# Altium project BM1387_USB.PrjPcb
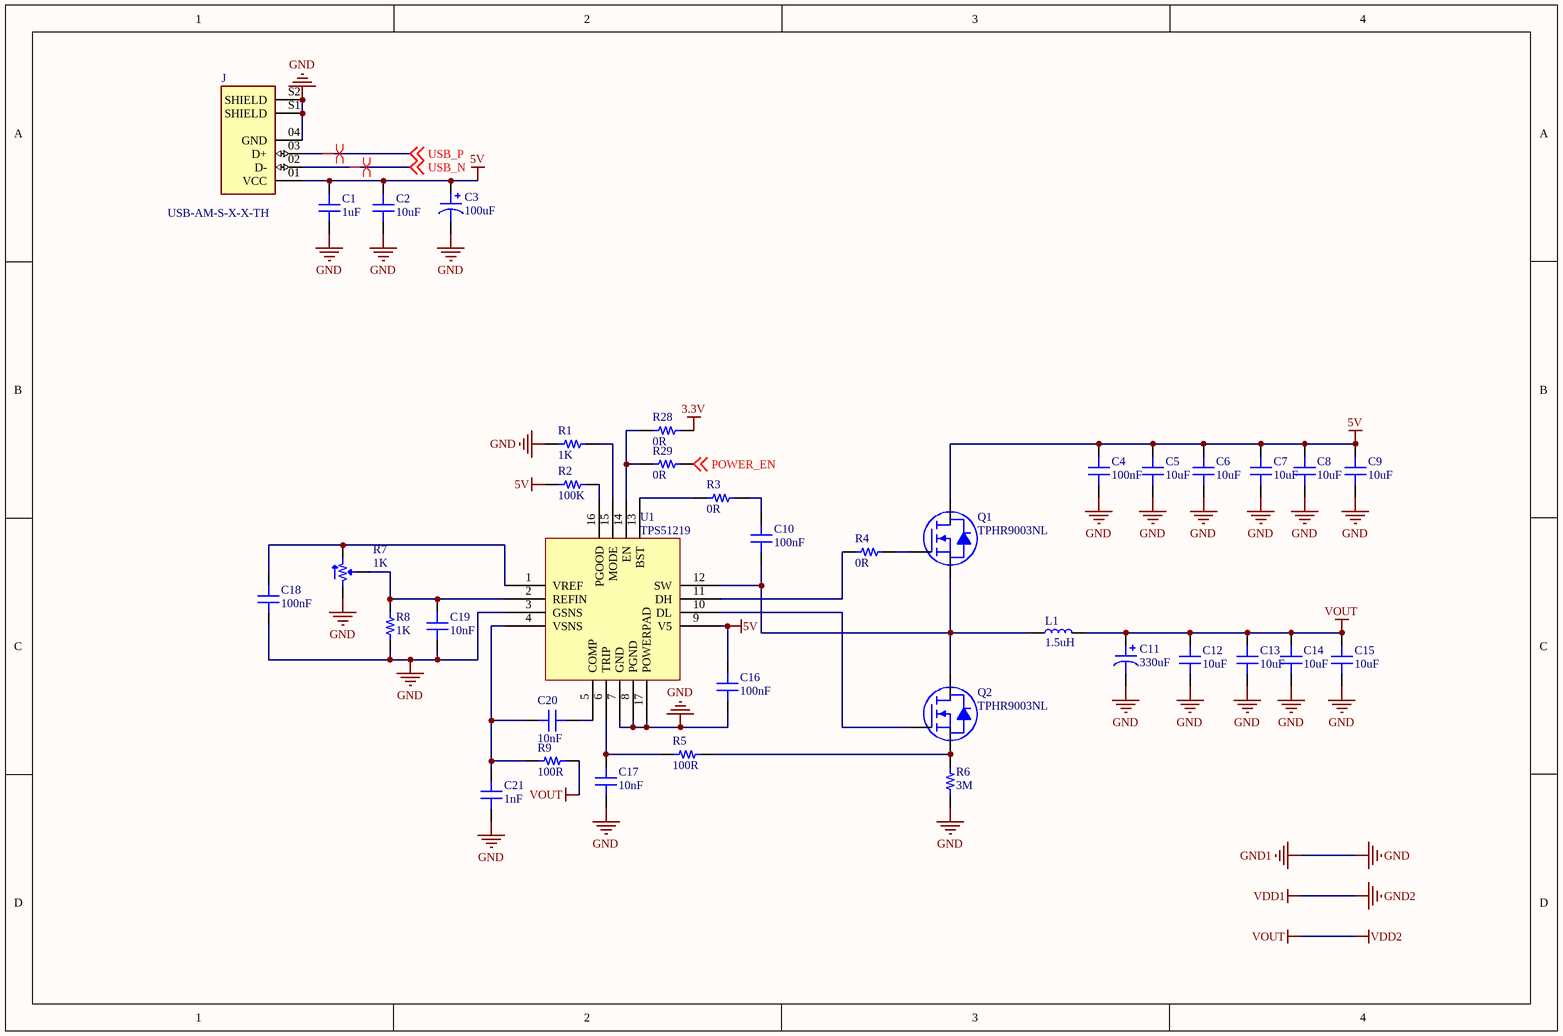
[diagram p0: POWER.SchDoc]
5 sheets, 92 parts. Net scope: global (net labels, ports and power ports of the same name join across sheets).
Board file: USB_MINER.PcbDoc
Sheets:
  USB_MINER.SchDoc
  POWER.SchDoc
  USB_TO_TTL.SchDoc
  BLOCK1.SchDoc
  BLOCK2.SchDoc

## Sheet USB_MINER.SchDoc
size A; SheetNumber: 1; SheetTotal: 1

## Sheet POWER.SchDoc
size A4; SheetNumber: 2; SheetTotal: 5

### Parts
C1  1uF  [CAP_SMD_1206]
C2  10uF  [CAP_SMD_1206]
C3  100uF  [CAP-TAN-CASE-B]
C4  100nF  [CAP-SMD-0603]
C5  10uF  [CAP-SMD-0603]
C6  10uF  [CAP-SMD-0603]
C7  10uF  [CAP-SMD-0603]
C8  10uF  [CAP-SMD-0603]
C9  10uF  [CAP-SMD-0603]
C10  100nF  [CAP-SMD-0603]
C11  330uF  [CAP-TAN-CASE-E]
C12  10uF  [CAP-SMD-0603]
C13  10uF  [CAP-SMD-0603]
C14  10uF  [CAP-SMD-0603]
C15  10uF  [CAP-SMD-0603]
C16  100nF  [CAP-SMD-0603]
C17  10nF  [CAP-SMD-0603]
C18  100nF  [CAP-SMD-0603]
C19  10nF  [CAP-SMD-0603]
C20  10nF  [CAP-SMD-0603]
C21  1nF  [CAP-SMD-0603]
J  USB-AM-S-X-X-TH  [SAMTEC_USB-AM-S-X-X-TH]
L1  1.5uH  [IND]
Q1  TPHR9003NL  [ADVANCE SOP]
Q2  TPHR9003NL  [ADVANCE SOP]
R1  1K  [RES-SMD-0402]
R2  100K  [RES-SMD-0402]
R3  0R  [RES-SMD-0402]
R4  0R  [RES-SMD-0402]
R5  100R  [RES-SMD-0402]
R6  3M  [RES-SMD-0402]
R7  1K  [POT]
R8  1K  [RES-SMD-0402]
R9  100R  [RES-SMD-0402]
R28  0R  [RES-SMD-0402]
R29  0R  [RES-SMD-0402]
U1  TPS51219  [QFN50P300X300X80-17N]

### Nets
3.3V: R28.2
5V: C1.1 C2.1 C3.1 C4.1 C5.1 C6.1 C7.1 C8.1 C9.1 C16.1 J.01(VCC) Q1.D R2.2 U1.9(V5)
GND: C1.2 C2.2 C3.2 C4.2 C5.2 C6.2 C7.2 C8.2 C9.2 C11.2 C12.2 C13.2 C14.2 C15.2 C16.2 C17.2 C18.1 C19.1 C21.1 J.04(GND) J.S1(SHIELD) J.S2(SHIELD) R1.2 R6.2 R7.1 R8.2 U1.3(GSNS) U1.7(GND) U1.8(PGND) U1.17(POWERPAD)  [also labelled GND1]
VDD2: C11.1 C12.1 C13.1 C14.1 C15.1 L1.2 R9.1  [also labelled VOUT]
POWER_EN: R29.2 ; off-sheet POWER_EN
USB_N: J.02(D-) ; off-sheet USB_N
USB_P: J.03(D+) ; off-sheet USB_P
NetC10_1: C10.1 R3.1
NetC10_2: C10.2 L1.1 Q1.S Q2.D U1.12(SW)
NetC17_1: C17.1 R5.2 U1.6(TRIP)
NetC18_2: C18.2 R7.3 U1.1(VREF)
NetC19_2: C19.2 R7.2 R8.1 U1.2(REFIN)
NetC20_1: C20.1 C21.2 R9.2 U1.4(VSNS)
NetC20_2: C20.2 U1.5(COMP)
NetQ1_G: Q1.G R4.1
NetQ2_G: Q2.G U1.10(DL)
NetQ2_S: Q2.S R5.1 R6.1
NetR1_1: R1.1 U1.15(MODE)
NetR2_1: R2.1 U1.16(PGOOD)
NetR3_2: R3.2 U1.13(BST)
NetR4_2: R4.2 U1.11(DH)
NetR28_1: R28.1 R29.1 U1.14(EN)

### Layout directives
differential pair: USB_N, USB_P

### Library data of the parts
C1 C2 C4-C10 C12-C21 = CAP
C3 C11 = POLARIZED CAP
J = USB-AM-S-X-X-TH: USB-A (USB TYPE-A) USB 2.0 Plug Connector 4 Position Through Hole, Right Angle; MF: Samtec; MP: USB-AM-S-F-B-TH; Toby_UK-Purchase-URL: https://snapeda.com/shop?store=Toby+UK&id=474273; Price: None; SnapEDA_Link: https://www.snapeda.com/parts/USB-AM-S-F-B-TH/Samtec%20Inc./view-part/474273/?ref=snap; Availability: Unavailable; Package: None; Value: *
L1 = INDUCTOR
Q1 Q2 = MOSFET-N
R1-R6 R8 R9 R28 R29 = RES
R7 = Potentiometer

## Sheet USB_TO_TTL.SchDoc
size A4; SheetNumber: 3; SheetTotal: 5
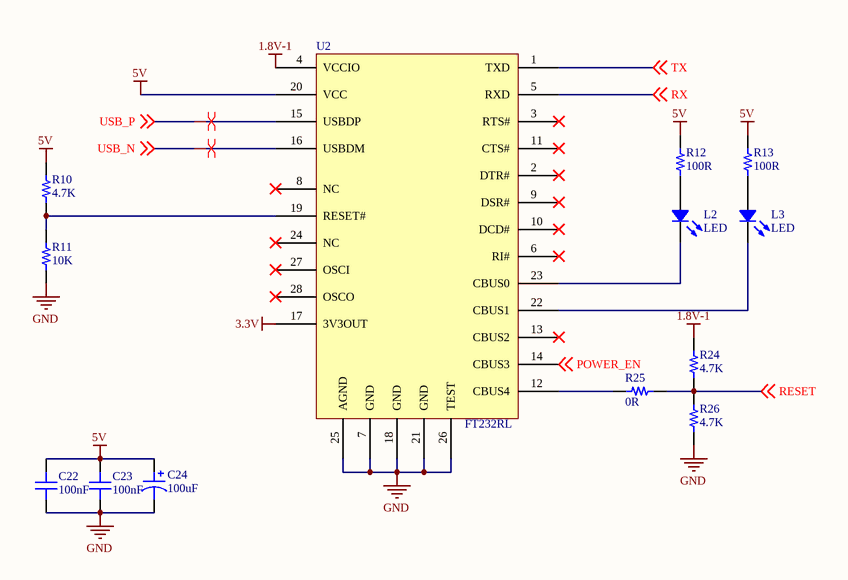
[diagram p1: USB_TO_TTL.SchDoc]

### Parts
C22  100nF  [CAP-SMD-0402]
C23  100nF  [CAP-SMD-0402]
C24  100uF  [CAP-TAN-CASE-B]
L2  LED  [LED-SMD-0805]
L3  LED  [LED-SMD-0805]
R10  4.7K  [RES-SMD-0402]
R11  10K  [RES-SMD-0402]
R12  100R  [RES-SMD-0402]
R13  100R  [RES-SMD-0402]
R24  4.7K  [RES-SMD-0402]
R25  0R  [RES-SMD-0402]
R26  4.7K  [RES-SMD-0402]
U2  FT232RL  [SSOP]

### Nets
1.8V-1: R24.2 U2.4(VCCIO)
3.3V: U2.17(3V3OUT)
5V: C22.2 C23.2 C24.1 R10.2 R12.2 R13.2 U2.20(VCC)
GND: C22.1 C23.1 C24.2 R11.1 R26.1 U2.7(GND) U2.18(GND) U2.21(GND) U2.25(AGND) U2.26(TEST)
POWER_EN: U2.14(CBUS3) ; off-sheet POWER_EN
RESET: R24.1 R25.1 R26.2 ; off-sheet RESET
RX: U2.5(RXD) ; off-sheet RX
TX: U2.1(TXD) ; off-sheet TX
USB_N: U2.16(USBDM) ; off-sheet USB_N
USB_P: U2.15(USBDP) ; off-sheet USB_P
NetL2_1: L2.1 R12.1
NetL2_2: L2.2 U2.23(CBUS0)
NetL3_1: L3.1 R13.1
NetL3_2: L3.2 U2.22(CBUS1)
NetR10_1: R10.1 R11.2 U2.19(RESET#)
NetR25_2: R25.2 U2.12(CBUS4)

Not connected (* = marked no-connect by the designer): U2 2(DTR#)* 3(RTS#)* 6(RI#)* 8(NC)* 9(DSR#)* 10(DCD#)* 11(CTS#)* 13(CBUS2)* 24(NC)* 27(OSCI)* 28(OSCO)*

### Layout directives
differential pair: USB_N, USB_P

### Library data of the parts
C22 C23 = CAP
C24 = POLARIZED CAP
R10-R13 R24-R26 = RES

## Sheet BLOCK1.SchDoc
size A4; SheetNumber: 4; SheetTotal: 5
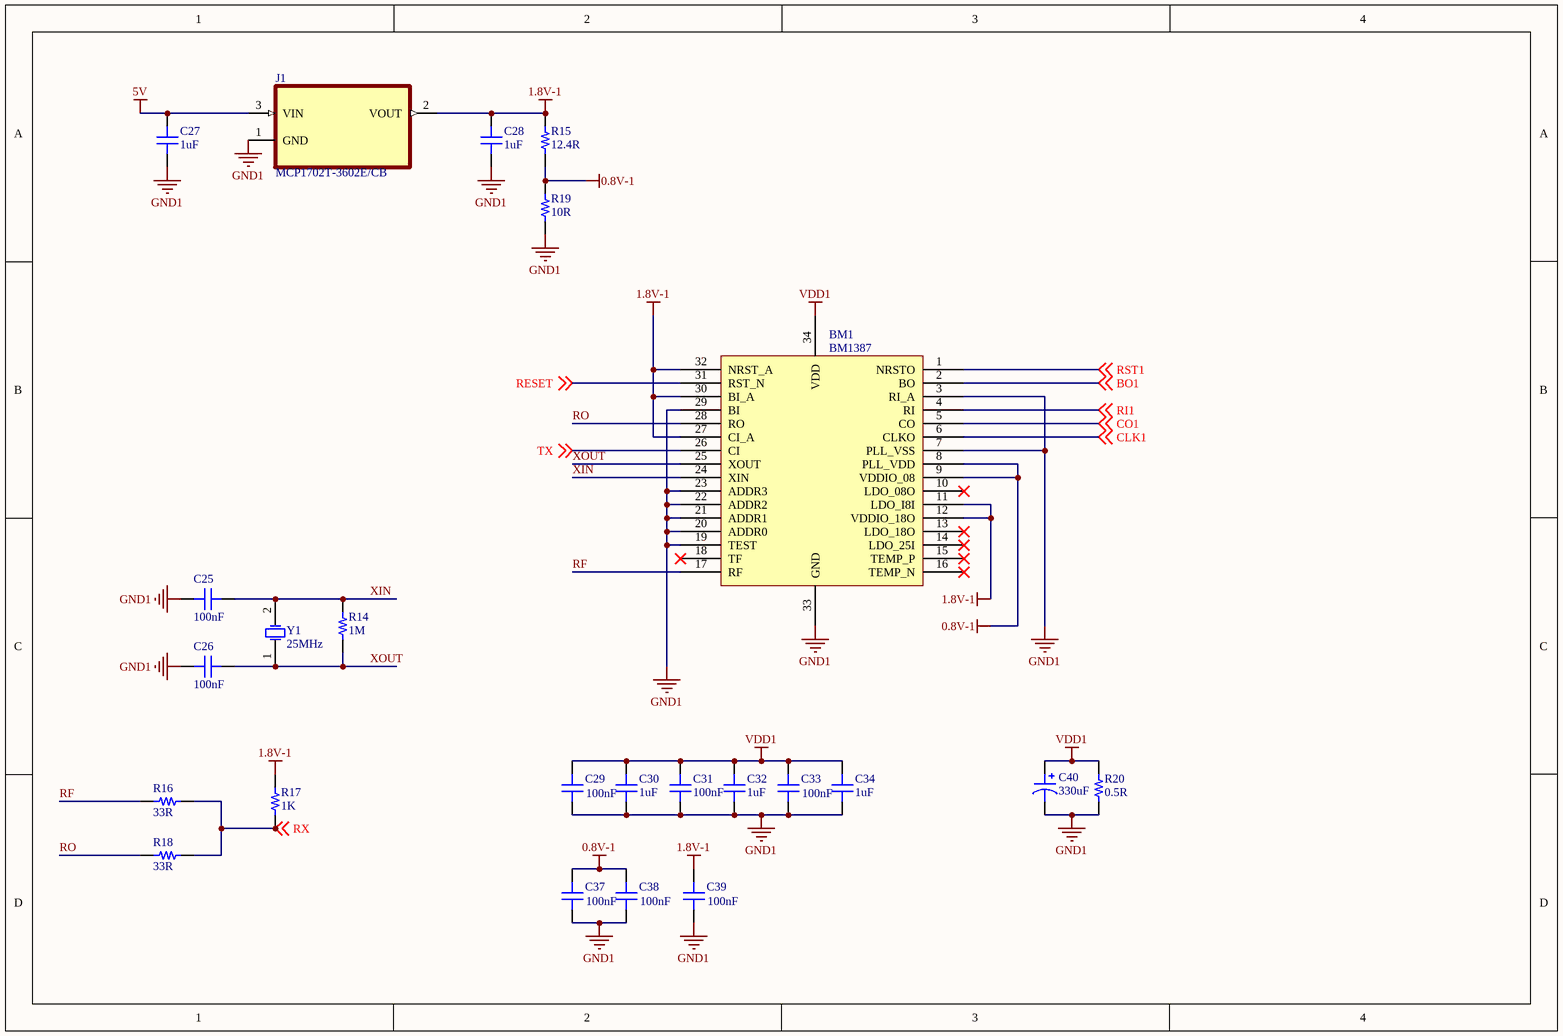
[diagram p2: BLOCK1.SchDoc]

### Parts
BM1  BM1387  [BM1387]
C25  100nF  [CAP-SMD-0402]
C26  100nF  [CAP-SMD-0402]
C27  1uF  [CAP-SMD-0402]
C28  1uF  [CAP-SMD-0402]
C29  100nF  [CAP_SMD_1206]
C30  1uF  [CAP_SMD_1206]
C31  100nF  [CAP_SMD_1206]
C32  1uF  [CAP_SMD_1206]
C33  100nF  [CAP_SMD_1206]
C34  1uF  [CAP_SMD_1206]
C37  100nF  [CAP-SMD-0402]
C38  100nF  [CAP-SMD-0402]
C39  100nF  [CAP-SMD-0402]
C40  330uF  [CAP-TAN-CASE-E]
J1  MCP1702T-3602E/CB  [SOT95P255X145-3N]
R14  1M  [RES-SMD-0402]
R15  12.4R  [RES-SMD-0402]
R16  33R  [RES-SMD-0402]
R17  1K  [RES-SMD-0402]
R18  33R  [RES-SMD-0402]
R19  10R  [RES-SMD-0402]
R20  0.5R  [RES-SMD-1206]
Y1  25MHz  [XTALL]

### Nets
0.8V-1: BM1.8(PLL_VDD) BM1.9(VDDIO_08) C37.2 C38.2 R15.1 R19.2
1.8V-1: BM1.11(LDO_I8I) BM1.12(VDDIO_18O) BM1.27(CI_A) BM1.30(BI_A) BM1.32(NRST_A) C28.2 C39.2 J1.2(VOUT) R15.2 R17.2
5V: C27.2 J1.3(VIN)
GND1: BM1.3(RI_A) BM1.7(PLL_VSS) BM1.19(TEST) BM1.20(ADDR0) BM1.21(ADDR1) BM1.22(ADDR2) BM1.23(ADDR3) BM1.29(BI) BM1.33(GND) C25.1 C26.1 C27.1 C28.1 C29.1 C30.1 C31.1 C32.1 C33.1 C34.1 C37.1 C38.1 C39.1 C40.2 J1.1(GND) R19.1 R20.1  [project net GND]
VDD1: BM1.34(VDD) C29.2 C30.2 C31.2 C32.2 C33.2 C34.2 C40.1 R20.2  [project net GND2]
BO1: BM1.2(BO) ; off-sheet BO1
CLK1: BM1.6(CLKO) ; off-sheet CLK1
CO1: BM1.5(CO) ; off-sheet CO1
RESET: BM1.31(RST_N) ; off-sheet RESET
RF: BM1.17(RF) R16.1
RI1: BM1.4(RI) ; off-sheet RI1
RO: BM1.28(RO) R18.1
RST1: BM1.1(NRSTO) ; off-sheet RST1
RX: R16.2 R17.1 R18.2 ; off-sheet RX
TX: BM1.26(CI) ; off-sheet TX
XIN: BM1.24(XIN) C25.2 R14.2 Y1.2(OSC2)
XOUT: BM1.25(XOUT) C26.2 R14.1 Y1.1(OSC1)

Not connected (* = marked no-connect by the designer): BM1 10(LDO_08O)* 13(LDO_18O)* 14(LDO_25I)* 15(TEMP_P)* 16(TEMP_N)* 18(TF)*

### Library data of the parts
C25-C34 C37-C39 = CAP
C40 = POLARIZED CAP
J1 = MCP1702T-3602E/CB: 250 mA Low Quiescent Current LDO Regulator; Package: None; Price: None; Value: *; MP: MCP1702T-3602E/CB; Availability: Unavailable
R14-R20 = RES
Y1 = XTAL: Crystal Oscillator; Published: 8-Jun-2000; LatestRevisionDate: 17-Jul-2002; LatestRevisionNote: Re-released for DXP Platform.; PackageReference: R38; Publisher: Altium Limited; PackageDescription: Crystal, Thru-Hole; 2 Leads; Body 3.1 x 8.2 mm (Dia.xH); Value: 25MHz

## Sheet BLOCK2.SchDoc
size A4; SheetNumber: 5; SheetTotal: 5
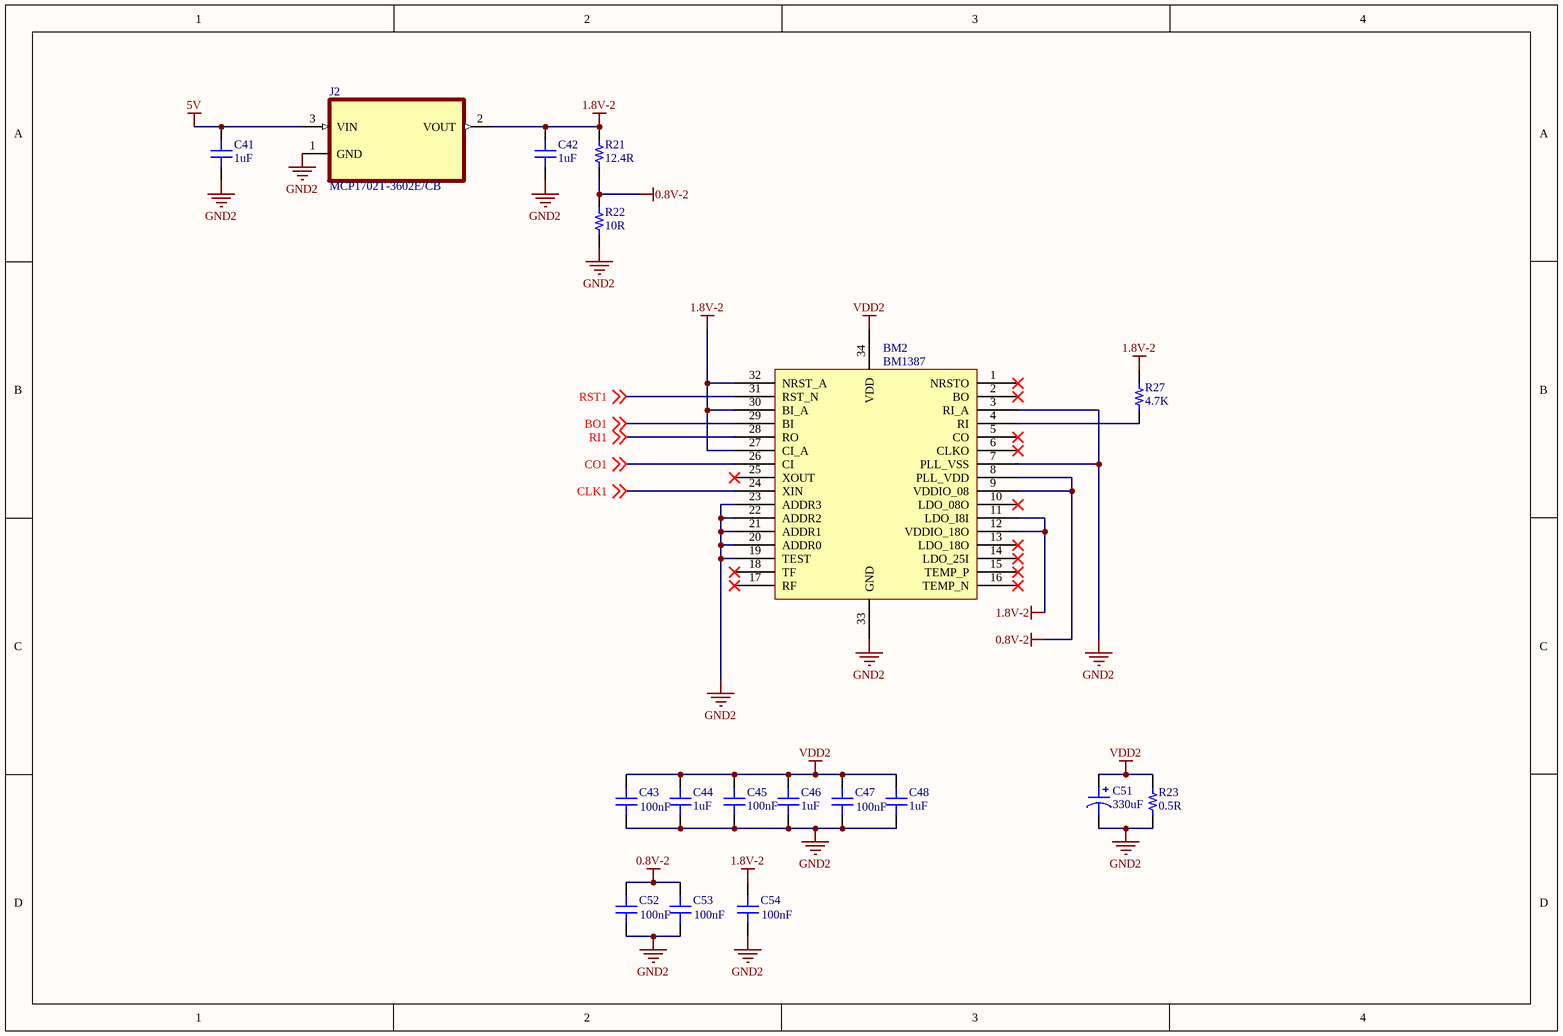
[diagram p3: BLOCK2.SchDoc]

### Parts
BM2  BM1387  [BM1387]
C41  1uF  [CAP-SMD-0402]
C42  1uF  [CAP-SMD-0402]
C43  100nF  [CAP_SMD_1206]
C44  1uF  [CAP_SMD_1206]
C45  100nF  [CAP_SMD_1206]
C46  1uF  [CAP_SMD_1206]
C47  100nF  [CAP_SMD_1206]
C48  1uF  [CAP_SMD_1206]
C51  330uF  [CAP-TAN-CASE-E]
C52  100nF  [CAP-SMD-0402]
C53  100nF  [CAP-SMD-0402]
C54  100nF  [CAP-SMD-0402]
J2  MCP1702T-3602E/CB  [SOT95P255X145-3N]
R21  12.4R  [RES-SMD-0402]
R22  10R  [RES-SMD-0402]
R23  0.5R  [RES-SMD-1206]
R27  4.7K  [RES-SMD-0402]

### Nets
0.8V-2: BM2.8(PLL_VDD) BM2.9(VDDIO_08) C52.2 C53.2 R21.1 R22.2
1.8V-2: BM2.11(LDO_I8I) BM2.12(VDDIO_18O) BM2.27(CI_A) BM2.30(BI_A) BM2.32(NRST_A) C42.2 C54.2 J2.2(VOUT) R21.2 R27.2
5V: C41.2 J2.3(VIN)
GND2: BM2.3(RI_A) BM2.7(PLL_VSS) BM2.19(TEST) BM2.20(ADDR0) BM2.21(ADDR1) BM2.22(ADDR2) BM2.23(ADDR3) BM2.33(GND) C41.1 C42.1 C43.1 C44.1 C45.1 C46.1 C47.1 C48.1 C51.2 C52.1 C53.1 C54.1 J2.1(GND) R22.1 R23.1
VDD2: BM2.34(VDD) C43.2 C44.2 C45.2 C46.2 C47.2 C48.2 C51.1 R23.2
BO1: BM2.29(BI) ; off-sheet BO1
CLK1: BM2.24(XIN) ; off-sheet CLK1
CO1: BM2.26(CI) ; off-sheet CO1
RI1: BM2.28(RO) ; off-sheet RI1
RST1: BM2.31(RST_N) ; off-sheet RST1
NetBM2_4: BM2.4(RI) R27.1

Not connected (* = marked no-connect by the designer): BM2 1(NRSTO)* 2(BO)* 5(CO)* 6(CLKO)* 10(LDO_08O)* 13(LDO_18O)* 14(LDO_25I)* 15(TEMP_P)* 16(TEMP_N)* 17(RF)* 18(TF)* 25(XOUT)*

### Library data of the parts
C41-C48 C52-C54 = CAP
C51 = POLARIZED CAP
J2 = MCP1702T-3602E/CB: as J1 on sheet BLOCK1; Package: None; Price: None; Value: *; MP: MCP1702T-3602E/CB; Availability: Unavailable
R21-R23 R27 = RES

## Nets that join several sheets
1.8V-1: USB_TO_TTL (R24.2 U2.4), BLOCK1 (10 pins)
3.3V: POWER (R28.2), USB_TO_TTL (U2.17)
5V: POWER (14 pins), USB_TO_TTL (7 pins), BLOCK1 (C27.2 J1.3), BLOCK2 (C41.2 J2.3)
GND: POWER (30 pins), USB_TO_TTL (10 pins), BLOCK1 (26 pins)
GND2: BLOCK1 (9 pins), BLOCK2 (23 pins)
VDD2: POWER (7 pins), BLOCK2 (9 pins)
BO1: BLOCK1 (BM1.2), BLOCK2 (BM2.29)
CLK1: BLOCK1 (BM1.6), BLOCK2 (BM2.24)
CO1: BLOCK1 (BM1.5), BLOCK2 (BM2.26)
POWER_EN: POWER (R29.2), USB_TO_TTL (U2.14)
RESET: USB_TO_TTL (R24.1 R25.1 R26.2), BLOCK1 (BM1.31)
RI1: BLOCK1 (BM1.4), BLOCK2 (BM2.28)
RST1: BLOCK1 (BM1.1), BLOCK2 (BM2.31)
RX: USB_TO_TTL (U2.5), BLOCK1 (R16.2 R17.1 R18.2)
TX: USB_TO_TTL (U2.1), BLOCK1 (BM1.26)
USB_N: POWER (J.02), USB_TO_TTL (U2.16)
USB_P: POWER (J.03), USB_TO_TTL (U2.15)